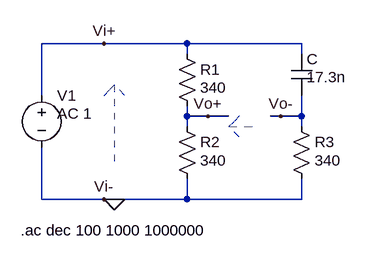
[diagram p0: schematic ej6a.asc]
ej6a.asc, the LTspice schematic file:
Version 4
SHEET 1 1036 680
WIRE 640 -256 544 -256
WIRE 768 -256 640 -256
WIRE 944 -256 768 -256
WIRE 768 -240 768 -256
WIRE 944 -240 944 -256
WIRE 544 -176 544 -256
WIRE 768 -144 768 -160
WIRE 800 -144 768 -144
WIRE 832 -144 800 -144
WIRE 912 -144 896 -144
WIRE 944 -144 944 -176
WIRE 944 -144 912 -144
WIRE 768 -128 768 -144
WIRE 944 -128 944 -144
WIRE 544 -16 544 -96
WIRE 640 -16 544 -16
WIRE 656 -16 640 -16
WIRE 768 -16 768 -48
WIRE 768 -16 656 -16
WIRE 944 -16 944 -48
WIRE 944 -16 768 -16
FLAG 800 -144 Vo+
FLAG 912 -144 Vo-
FLAG 640 -256 Vi+
FLAG 640 -16 Vi-
FLAG 656 -16 0
SYMBOL cap 928 -240 R0
WINDOW 3 24 36 Left 2
SYMATTR Value 17.3n
SYMATTR InstName C
SYMBOL res 752 -256 R0
WINDOW 3 36 68 Left 2
SYMATTR Value 340
SYMATTR InstName R1
SYMBOL res 752 -144 R0
WINDOW 3 36 68 Left 2
SYMATTR Value 340
SYMATTR InstName R2
SYMBOL res 928 -144 R0
WINDOW 3 36 68 Left 2
SYMATTR Value 340
SYMATTR InstName R3
SYMBOL voltage 544 -192 R0
WINDOW 123 24 44 Left 2
WINDOW 39 0 0 Left 0
SYMATTR Value2 AC 1
SYMATTR InstName V1
SYMATTR Value ""
TEXT 512 32 Left 2 !.ac dec 100 1000 1000000
LINE Normal 656 -192 656 -64 2
LINE Normal 640 -176 656 -192 2
LINE Normal 656 -192 640 -176 2
LINE Normal 672 -176 656 -192 2
LINE Normal 832 -128 880 -128 2
LINE Normal 848 -144 832 -128 2
LINE Normal 832 -128 848 -144 2
LINE Normal 848 -112 832 -128 2

The netlist it stands for:
* ej6a.asc
C Vi+ Vo- 17.3n
R1 Vi+ Vo+ 340
R2 Vo+ 0 340
R3 Vo- 0 340
V1 Vi+ 0 AC 1
.ac dec 100 1000 1000000
.backanno
.end